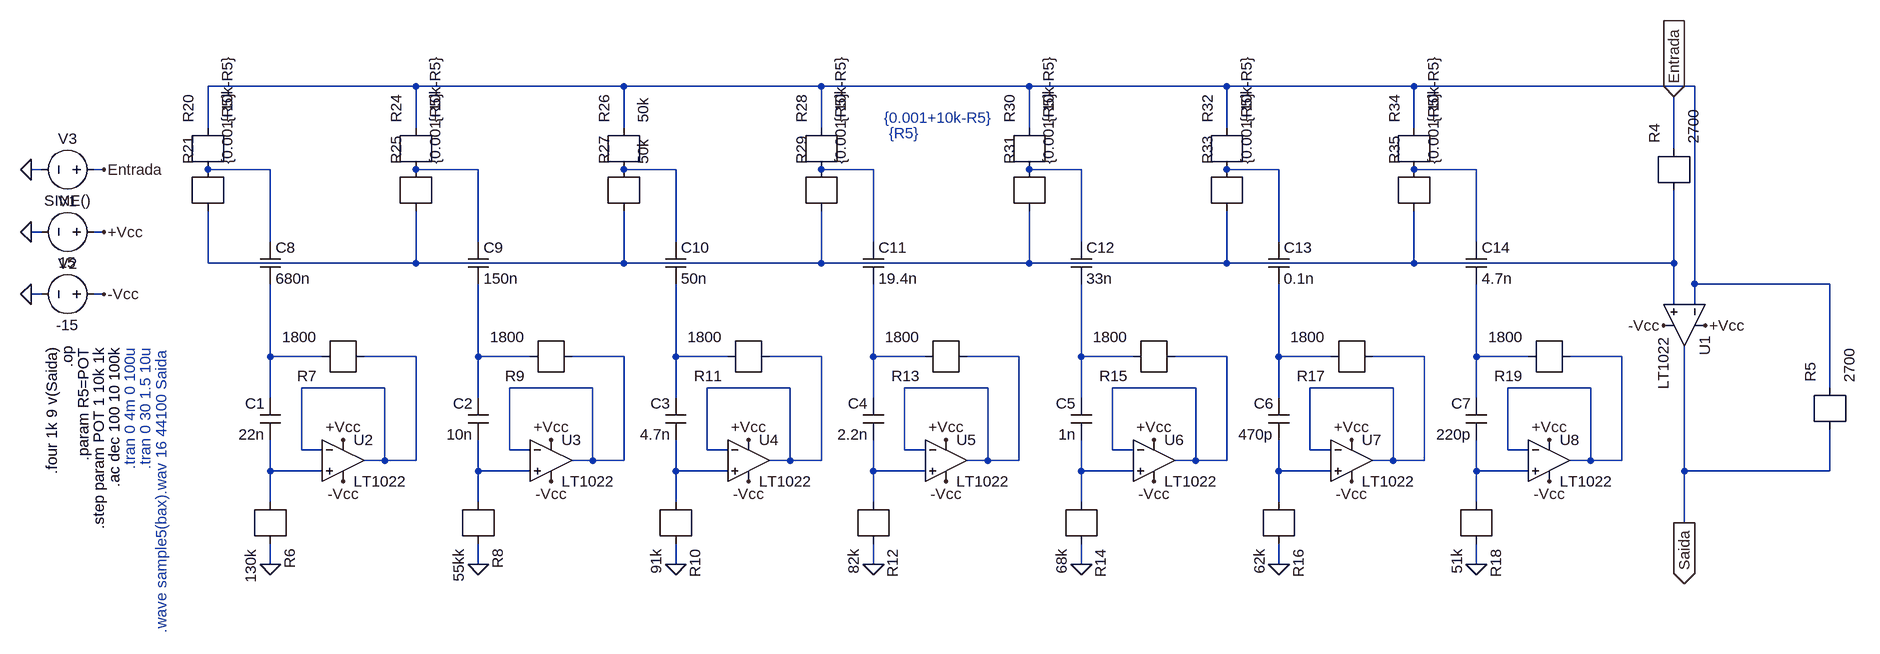
[diagram p0: schematic Lab_Max_2.2.asc]
Lab_Max_2.2.asc, the LTspice schematic file:
Version 4
SHEET 1 2244 1136
WIRE -16 288 -336 288
WIRE 304 288 -16 288
WIRE 608 288 304 288
WIRE 928 288 608 288
WIRE 1232 288 928 288
WIRE 1520 288 1232 288
WIRE 1952 288 1520 288
WIRE -336 352 -336 288
WIRE -16 352 -16 288
WIRE 304 352 304 288
WIRE 608 352 608 288
WIRE 928 352 928 288
WIRE 1232 352 1232 288
WIRE 1520 352 1520 288
WIRE 1920 384 1920 304
WIRE -592 416 -608 416
WIRE -496 416 -512 416
WIRE -240 416 -336 416
WIRE 80 416 -16 416
WIRE 384 416 304 416
WIRE 688 416 608 416
WIRE 1008 416 928 416
WIRE 1312 416 1232 416
WIRE 1616 416 1520 416
WIRE -592 512 -608 512
WIRE -496 512 -512 512
WIRE -240 528 -240 416
WIRE 80 528 80 416
WIRE 384 528 384 416
WIRE 688 528 688 416
WIRE 1008 528 1008 416
WIRE 1312 528 1312 416
WIRE 1616 528 1616 416
WIRE -336 560 -336 480
WIRE -16 560 -16 480
WIRE -16 560 -336 560
WIRE 304 560 304 480
WIRE 304 560 -16 560
WIRE 608 560 608 480
WIRE 608 560 304 560
WIRE 928 560 928 480
WIRE 928 560 608 560
WIRE 1232 560 1232 480
WIRE 1232 560 928 560
WIRE 1520 560 1520 480
WIRE 1520 560 1232 560
WIRE 1920 560 1920 448
WIRE 1920 560 1520 560
WIRE 1952 592 1952 288
WIRE 2160 592 1952 592
WIRE -592 608 -608 608
WIRE -496 608 -512 608
WIRE 1920 624 1920 560
WIRE 1952 624 1952 592
WIRE -240 704 -240 592
WIRE -160 704 -240 704
WIRE -16 704 -96 704
WIRE 80 704 80 592
WIRE 160 704 80 704
WIRE 304 704 224 704
WIRE 384 704 384 592
WIRE 464 704 384 704
WIRE 608 704 528 704
WIRE 688 704 688 592
WIRE 768 704 688 704
WIRE 912 704 832 704
WIRE 1008 704 1008 592
WIRE 1088 704 1008 704
WIRE 1232 704 1152 704
WIRE 1312 704 1312 592
WIRE 1392 704 1312 704
WIRE 1536 704 1456 704
WIRE 1616 704 1616 592
WIRE 1696 704 1616 704
WIRE 1840 704 1760 704
WIRE -64 752 -192 752
WIRE 256 752 128 752
WIRE 560 752 432 752
WIRE 864 752 736 752
WIRE 1184 752 1056 752
WIRE 1488 752 1360 752
WIRE 1792 752 1664 752
WIRE 2160 752 2160 592
WIRE -240 768 -240 704
WIRE 80 768 80 704
WIRE 384 768 384 704
WIRE 688 768 688 704
WIRE 1008 768 1008 704
WIRE 1312 768 1312 704
WIRE 1616 768 1616 704
WIRE -192 848 -192 752
WIRE -160 848 -192 848
WIRE 128 848 128 752
WIRE 160 848 128 848
WIRE 432 848 432 752
WIRE 464 848 432 848
WIRE 736 848 736 752
WIRE 768 848 736 848
WIRE 1056 848 1056 752
WIRE 1088 848 1056 848
WIRE 1360 848 1360 752
WIRE 1392 848 1360 848
WIRE 1664 848 1664 752
WIRE 1696 848 1664 848
WIRE -64 864 -64 752
WIRE -64 864 -96 864
WIRE -16 864 -16 704
WIRE -16 864 -64 864
WIRE 256 864 256 752
WIRE 256 864 224 864
WIRE 304 864 304 704
WIRE 304 864 256 864
WIRE 560 864 560 752
WIRE 560 864 528 864
WIRE 608 864 608 704
WIRE 608 864 560 864
WIRE 864 864 864 752
WIRE 864 864 832 864
WIRE 912 864 912 704
WIRE 912 864 864 864
WIRE 1184 864 1184 752
WIRE 1184 864 1152 864
WIRE 1232 864 1232 704
WIRE 1232 864 1184 864
WIRE 1488 864 1488 752
WIRE 1488 864 1456 864
WIRE 1536 864 1536 704
WIRE 1536 864 1488 864
WIRE 1792 864 1792 752
WIRE 1792 864 1760 864
WIRE 1840 864 1840 704
WIRE 1840 864 1792 864
WIRE -240 880 -240 832
WIRE -160 880 -240 880
WIRE 80 880 80 832
WIRE 160 880 80 880
WIRE 384 880 384 832
WIRE 464 880 384 880
WIRE 688 880 688 832
WIRE 768 880 688 880
WIRE 1008 880 1008 832
WIRE 1088 880 1008 880
WIRE 1312 880 1312 832
WIRE 1392 880 1312 880
WIRE 1616 880 1616 832
WIRE 1696 880 1616 880
WIRE 1936 880 1936 688
WIRE 2160 880 2160 816
WIRE 2160 880 1936 880
WIRE -240 928 -240 880
WIRE 80 928 80 880
WIRE 384 928 384 880
WIRE 688 928 688 880
WIRE 1008 928 1008 880
WIRE 1312 928 1312 880
WIRE 1616 928 1616 880
WIRE 1936 960 1936 880
WIRE -240 1024 -240 992
WIRE 80 1024 80 992
WIRE 384 1024 384 992
WIRE 688 1024 688 992
WIRE 1008 1024 1008 992
WIRE 1312 1024 1312 992
WIRE 1616 1024 1616 992
FLAG -496 512 +Vcc
FLAG -496 608 -Vcc
FLAG -608 608 0
FLAG -608 512 0
FLAG 1968 656 +Vcc
FLAG 1904 656 -Vcc
FLAG 1920 304 Entrada
IOPIN 1920 304 In
FLAG 1936 960 Saida
IOPIN 1936 960 Out
FLAG -496 416 Entrada
FLAG -608 416 0
FLAG -128 832 +Vcc
FLAG -128 896 -Vcc
FLAG -240 1024 0
FLAG 192 832 +Vcc
FLAG 192 896 -Vcc
FLAG 80 1024 0
FLAG 496 832 +Vcc
FLAG 496 896 -Vcc
FLAG 384 1024 0
FLAG 800 832 +Vcc
FLAG 800 896 -Vcc
FLAG 688 1024 0
FLAG 1120 832 +Vcc
FLAG 1120 896 -Vcc
FLAG 1008 1024 0
FLAG 1424 832 +Vcc
FLAG 1424 896 -Vcc
FLAG 1312 1024 0
FLAG 1728 832 +Vcc
FLAG 1728 896 -Vcc
FLAG 1616 1024 0
SYMBOL opamps/LT1022 2000 656 R90
SYMATTR InstName U1
SYMBOL voltage -496 512 R90
WINDOW 0 -32 56 VBottom 2
WINDOW 3 32 56 VTop 2
SYMATTR InstName V1
SYMATTR Value 15
SYMBOL voltage -496 608 R90
WINDOW 0 -32 56 VBottom 2
WINDOW 3 32 56 VTop 2
SYMATTR InstName V2
SYMATTR Value -15
SYMBOL r 1920 448 R270
SYMATTR InstName R4
SYMATTR Value 2700
SYMBOL r 2160 816 R270
SYMATTR InstName R5
SYMATTR Value 2700
SYMBOL voltage -496 416 R90
WINDOW 0 -32 56 VBottom 2
WINDOW 3 32 56 VTop 2
SYMATTR InstName V3
SYMATTR Value SINE()
SYMATTR Value2 AC 1
SYMBOL opamps/LT1022 -128 800 R0
SYMATTR InstName U2
SYMBOL r -240 928 R90
SYMATTR InstName R6
SYMATTR Value 130k
SYMBOL cap -224 832 R180
WINDOW 0 24 56 Left 2
WINDOW 3 24 8 Left 2
SYMATTR InstName C1
SYMATTR Value 22n
SYMBOL r -96 704 R180
SYMATTR InstName R7
SYMATTR Value 1800
SYMBOL opamps/LT1022 192 800 R0
SYMATTR InstName U3
SYMBOL r 80 928 R90
SYMATTR InstName R8
SYMATTR Value 55kk
SYMBOL cap 96 832 R180
WINDOW 0 24 56 Left 2
WINDOW 3 24 8 Left 2
SYMATTR InstName C2
SYMATTR Value 10n
SYMBOL r 224 704 R180
SYMATTR InstName R9
SYMATTR Value 1800
SYMBOL opamps/LT1022 496 800 R0
SYMATTR InstName U4
SYMBOL r 384 928 R90
SYMATTR InstName R10
SYMATTR Value 91k
SYMBOL cap 400 832 R180
WINDOW 0 24 56 Left 2
WINDOW 3 24 8 Left 2
SYMATTR InstName C3
SYMATTR Value 4.7n
SYMBOL r 528 704 R180
SYMATTR InstName R11
SYMATTR Value 1800
SYMBOL opamps/LT1022 800 800 R0
SYMATTR InstName U5
SYMBOL r 688 928 R90
SYMATTR InstName R12
SYMATTR Value 82k
SYMBOL cap 704 832 R180
WINDOW 0 24 56 Left 2
WINDOW 3 24 8 Left 2
SYMATTR InstName C4
SYMATTR Value 2.2n
SYMBOL r 832 704 R180
SYMATTR InstName R13
SYMATTR Value 1800
SYMBOL opamps/LT1022 1120 800 R0
SYMATTR InstName U6
SYMBOL r 1008 928 R90
SYMATTR InstName R14
SYMATTR Value 68k
SYMBOL cap 1024 832 R180
WINDOW 0 24 56 Left 2
WINDOW 3 24 8 Left 2
SYMATTR InstName C5
SYMATTR Value 1n
SYMBOL r 1152 704 R180
SYMATTR InstName R15
SYMATTR Value 1800
SYMBOL opamps/LT1022 1424 800 R0
SYMATTR InstName U7
SYMBOL r 1312 928 R90
SYMATTR InstName R16
SYMATTR Value 62k
SYMBOL cap 1328 832 R180
WINDOW 0 24 56 Left 2
WINDOW 3 24 8 Left 2
SYMATTR InstName C6
SYMATTR Value 470p
SYMBOL r 1456 704 R180
SYMATTR InstName R17
SYMATTR Value 1800
SYMBOL opamps/LT1022 1728 800 R0
SYMATTR InstName U8
SYMBOL r 1616 928 R90
SYMATTR InstName R18
SYMATTR Value 51k
SYMBOL cap 1632 832 R180
WINDOW 0 24 56 Left 2
WINDOW 3 24 8 Left 2
SYMATTR InstName C7
SYMATTR Value 220p
SYMBOL r 1760 704 R180
SYMATTR InstName R19
SYMATTR Value 1800
SYMBOL cap -256 528 R0
SYMATTR InstName C8
SYMATTR Value 680n
SYMBOL cap 64 528 R0
SYMATTR InstName C9
SYMATTR Value 150n
SYMBOL cap 368 528 R0
SYMATTR InstName C10
SYMATTR Value 50n
SYMBOL cap 672 528 R0
SYMATTR InstName C11
SYMATTR Value 19.4n
SYMBOL cap 992 528 R0
SYMATTR InstName C12
SYMATTR Value 33n
SYMBOL cap 1296 528 R0
SYMATTR InstName C13
SYMATTR Value 0.1n
SYMBOL cap 1600 528 R0
SYMATTR InstName C14
SYMATTR Value 4.7n
SYMBOL r -336 416 R270
SYMATTR InstName R20
SYMATTR Value {R5}
SYMBOL r -336 480 R270
SYMATTR InstName R21
SYMATTR Value {0.001+10k-R5}
SYMBOL r -16 416 R270
SYMATTR InstName R24
SYMATTR Value {R5}
SYMBOL r -16 480 R270
SYMATTR InstName R25
SYMATTR Value {0.001+10k-R5}
SYMBOL r 304 416 R270
SYMATTR InstName R26
SYMATTR Value 50k
SYMBOL r 304 480 R270
SYMATTR InstName R27
SYMATTR Value 50k
SYMBOL r 608 416 R270
SYMATTR InstName R28
SYMATTR Value {R5}
SYMBOL r 608 480 R270
SYMATTR InstName R29
SYMATTR Value {0.001+10k-R5}
SYMBOL r 928 416 R270
SYMATTR InstName R30
SYMATTR Value {R5}
SYMBOL r 928 480 R270
SYMATTR InstName R31
SYMATTR Value {0.001+10k-R5}
SYMBOL r 1232 416 R270
SYMATTR InstName R32
SYMATTR Value {R5}
SYMBOL r 1232 480 R270
SYMATTR InstName R33
SYMATTR Value {0.001+10k-R5}
SYMBOL r 1520 416 R270
SYMATTR InstName R34
SYMATTR Value {R5}
SYMBOL r 1520 480 R270
SYMATTR InstName R35
SYMATTR Value {0.001+10k-R5}
TEXT -480 688 VRight 2 !.ac dec 100 10 100k
TEXT -576 688 VRight 2 !.four 1k 9 v(Saida)
TEXT -456 688 VRight 2 ;.tran 0 4m 0 100u
TEXT -504 688 VRight 2 !.step param POT 1 10k 1k
TEXT -528 688 VRight 2 !.param R5=POT
TEXT -552 688 VRight 2 !.op
TEXT 704 336 Left 2 ;{0.001+10k-R5}
TEXT 712 360 Left 2 ;{R5}
TEXT -432 688 VRight 2 ;.tran 0 30 1.5 10u
TEXT -408 688 VRight 2 ;.wave sample5(bax).wav 16 44100 Saida

The netlist it stands for:
* Lab_Max_2.2.asc
XU1 N009 N001 +Vcc -Vcc Saida LT1022  ; pins In+ In- V+ V- OUT
V1 +Vcc 0 15
V2 -Vcc 0 -15
R4 Entrada N009 2700
R5 N001 Saida 2700
V3 Entrada 0 SINE() AC 1
XU2 N024 N011 +Vcc -Vcc N011 LT1022  ; pins In+ In- V+ V- OUT
R6 0 N024 130k
C1 N024 N010 22n
R7 N010 N011 1800
XU3 N025 N013 +Vcc -Vcc N013 LT1022  ; pins In+ In- V+ V- OUT
R8 0 N025 55kk
C2 N025 N012 10n
R9 N012 N013 1800
XU4 N026 N015 +Vcc -Vcc N015 LT1022  ; pins In+ In- V+ V- OUT
R10 0 N026 91k
C3 N026 N014 4.7n
R11 N014 N015 1800
XU5 N027 N017 +Vcc -Vcc N017 LT1022  ; pins In+ In- V+ V- OUT
R12 0 N027 82k
C4 N027 N016 2.2n
R13 N016 N017 1800
XU6 N028 N019 +Vcc -Vcc N019 LT1022  ; pins In+ In- V+ V- OUT
R14 0 N028 68k
C5 N028 N018 1n
R15 N018 N019 1800
XU7 N029 N021 +Vcc -Vcc N021 LT1022  ; pins In+ In- V+ V- OUT
R16 0 N029 62k
C6 N029 N020 470p
R17 N020 N021 1800
XU8 N030 N023 +Vcc -Vcc N023 LT1022  ; pins In+ In- V+ V- OUT
R18 0 N030 51k
C7 N030 N022 220p
R19 N022 N023 1800
C8 N002 N010 680n
C9 N003 N012 150n
C10 N004 N014 50n
C11 N005 N016 19.4n
C12 N006 N018 33n
C13 N007 N020 0.1n
C14 N008 N022 4.7n
R20 N001 N002 {R5}
R21 N002 N009 {0.001+10k-R5}
R24 N001 N003 {R5}
R25 N003 N009 {0.001+10k-R5}
R26 N001 N004 50k
R27 N004 N009 50k
R28 N001 N005 {R5}
R29 N005 N009 {0.001+10k-R5}
R30 N001 N006 {R5}
R31 N006 N009 {0.001+10k-R5}
R32 N001 N007 {R5}
R33 N007 N009 {0.001+10k-R5}
R34 N001 N008 {R5}
R35 N008 N009 {0.001+10k-R5}
.ac dec 100 10 100k
.four 1k 9 v(Saida)
* .tran 0 4m 0 100u
.step param POT 1 10k 1k
.param R5=POT
.op
* {0.001+10k-R5}
* {R5}
* .tran 0 30 1.5 10u
* .wave sample5(bax).wav 16 44100 Saida
.backanno
.end